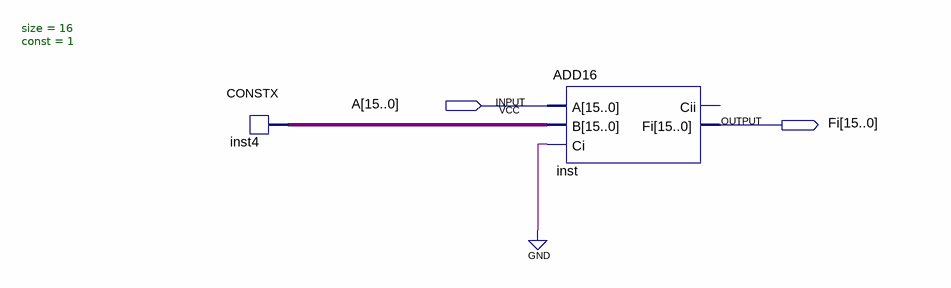
[diagram p0: schematic sheet]
// Quartus schematic INC16.bdf as structural Verilog: 2 symbols, 2 pins
module INC16 (
  input  [15:0] A,
  output [15:0] Fi
);

  wire [15:0] inst4_data;

  CONSTX #(.size(16), .\const (1)) inst4 (.data(inst4_data));
  ADD16 inst (.A(A), .B(inst4_data), .Ci(1'b0), .Fi(Fi));  // open: Cii
endmodule
